# Altium schematic sheet DAC.SchDoc
size A4; DocumentNumber: 8; SheetNumber: 8; SheetTotal: 10
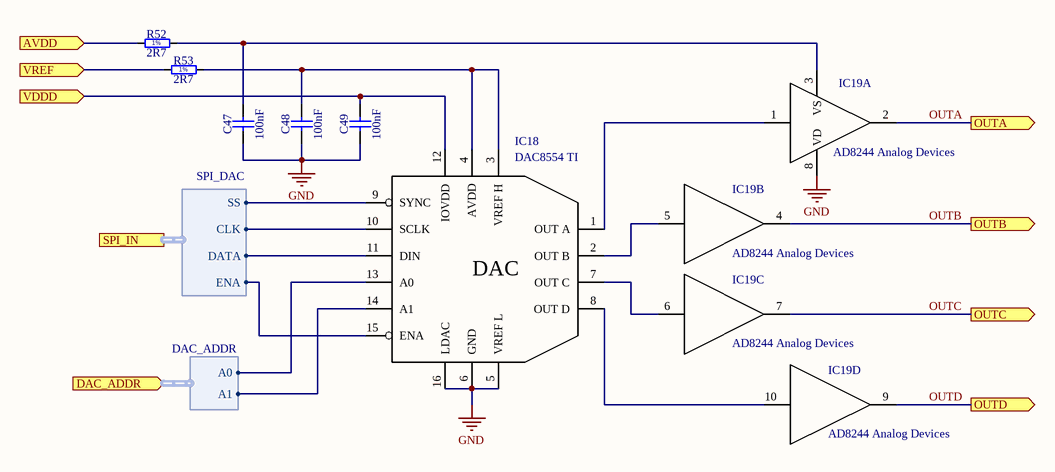
[diagram p0: DAC.SchDoc]

## Parts
C47  100nF  [CAPC2012X135N]
C48  100nF  [CAPC2012X135N]
C49  100nF  [CAPC2012X135N]
IC18  DAC8554 TI  [TSOP65P640X120-16N]
IC19  AD8244 Analog Devices  [TSSOP50P490X110-10N]  (parts A,B,C,D of 4)
R52  2R7  [RESC2012X60N]
R53  2R7  [RESC2012X60N]

## Ports
AVDD (in), DAC_ADDR (in, harness DAC_ADDR), OUTA (out), OUTB (out), OUTC (out), OUTD (out), SPI_IN (harness SPI_DAC), VDDD (in), VREF (in)

## Harnesses
SPI_DAC: DATA, CLK, SS, ENA
DAC_ADDR: A0, A1

## Nets
GND: C47.1 C48.1 C49.1 IC18.5(VREF_L) IC18.6(GND) IC18.16(LDAC) IC19.8(VD)
AVDD: R52.1 ; port AVDD
OUTA: IC19.2(OUT_A) ; port OUTA
OUTB: IC19.4(OUT_B) ; port OUTB
OUTC: IC19.7(OUT_C) ; port OUTC
OUTD: IC19.9(OUT_D) ; port OUTD
VDDD: C49.2 IC18.12(IOVDD) ; port VDDD
VREF: R53.1 ; port VREF
NetC47_2: C47.2 IC19.3(VS) R52.2
NetC48_2: C48.2 IC18.3(VREF_H) IC18.4(AVDD) R53.2
NetIC18_1: IC18.1(OUT_A) IC19.1(IN_A)
NetIC18_2: IC18.2(OUT_B) IC19.5(IN_B)
NetIC18_7: IC18.7(OUT_C) IC19.6(IN_C)
NetIC18_8: IC18.8(OUT_D) IC19.10(IN_D)
NetIC18_9: IC18.9(SYNC) ; port SPI_IN.SS
NetIC18_10: IC18.10(SCLK) ; port SPI_IN.CLK
NetIC18_11: IC18.11(DIN) ; port SPI_IN.DATA
NetIC18_13: IC18.13(A0) ; port DAC_ADDR.A0
NetIC18_14: IC18.14(A1) ; port DAC_ADDR.A1
NetIC18_15: IC18.15(ENA) ; port SPI_IN.ENA

## Notes on the sheet
- (in symbol DAC8554) DAC
- (in symbol R0805_2R7_1%_0.125W_200PPM) 1%

## Library data of the parts
C47-C49 = CC0805_100NF_50V_10%_X7R: Non-polarised capacitor; Part Description: SMD Multilayer Chip Ceramic Capacitor; Manufacturer: GENERIC; Manufacturer1 Part Number: C2012X7R1H104K085AA; Voltage: 50V; TC: X7R; Tolerance: ±10%; Part Number: CC0805_100NF_50V_10%_X7R; Component Kind: Standard; Component Type: Standard; Pin Count: 2; Value: 100nF; Status: Preferred; Manufacturer Part Number: CC0805_100NF_50V_10%_X7R; Case: 0805; Mounted: Yes; Socket: No; SMD: Yes; Sense: No; Manufacturer1 Example: TDK; Manufacturer1 ComponentHeight: 1mm; HelpURL: \\cern.ch\dfs\Applications\Altium\Datasheets\CC0805_X7R_TDK_C.pdf; Author: CERN DEM JLC; CreateDate: 03.12.2007; LatestRevisionDate: 22.04.2015
IC18 = DAC8554: Name: DAC8554; Manufacturer: TI
IC19 = AD8244: Name: AD8244; Manufacturer: Analog Devices
R52 R53 = R0805_2R7_1%_0.125W_200PPM: Resistor - 1%; Part Description: General Purpose Thick Film Chip Resistor; Manufacturer: GENERIC; Manufacturer1 Part Number: 232273462708L or RC0805FR-072R7L; Power: 0.125W; TC: ±200ppm/°C; PressFit: No; Part Number: R0805_2R7_1%_0.125W_200PPM; Component Kind: Standard; Component Type: Standard; Pin Count: 2; Value: 2R7; Status: Preferred; Tolerance: ±1%; Manufacturer Part Number: R0805_2R7_1%_0.125W_200PPM; Case: 0805; Mounted: Yes; Sense: No; Socket: No; SMD: Yes; Manufacturer1 Example: YAGEO PHYCOMP; Manufacturer1 ComponentHeight: 0.65mm; HelpURL: \\cern.ch\dfs\Applications\Altium\Datasheets\R0805_Phycomp_RC0805.pdf; Author: CERN DEM JLC; CreateDate: 03.12.2007; LatestRevisionDate: 17.10.2012